# EAGLE schematic purple_v2 (EAGLE 8.0.0)
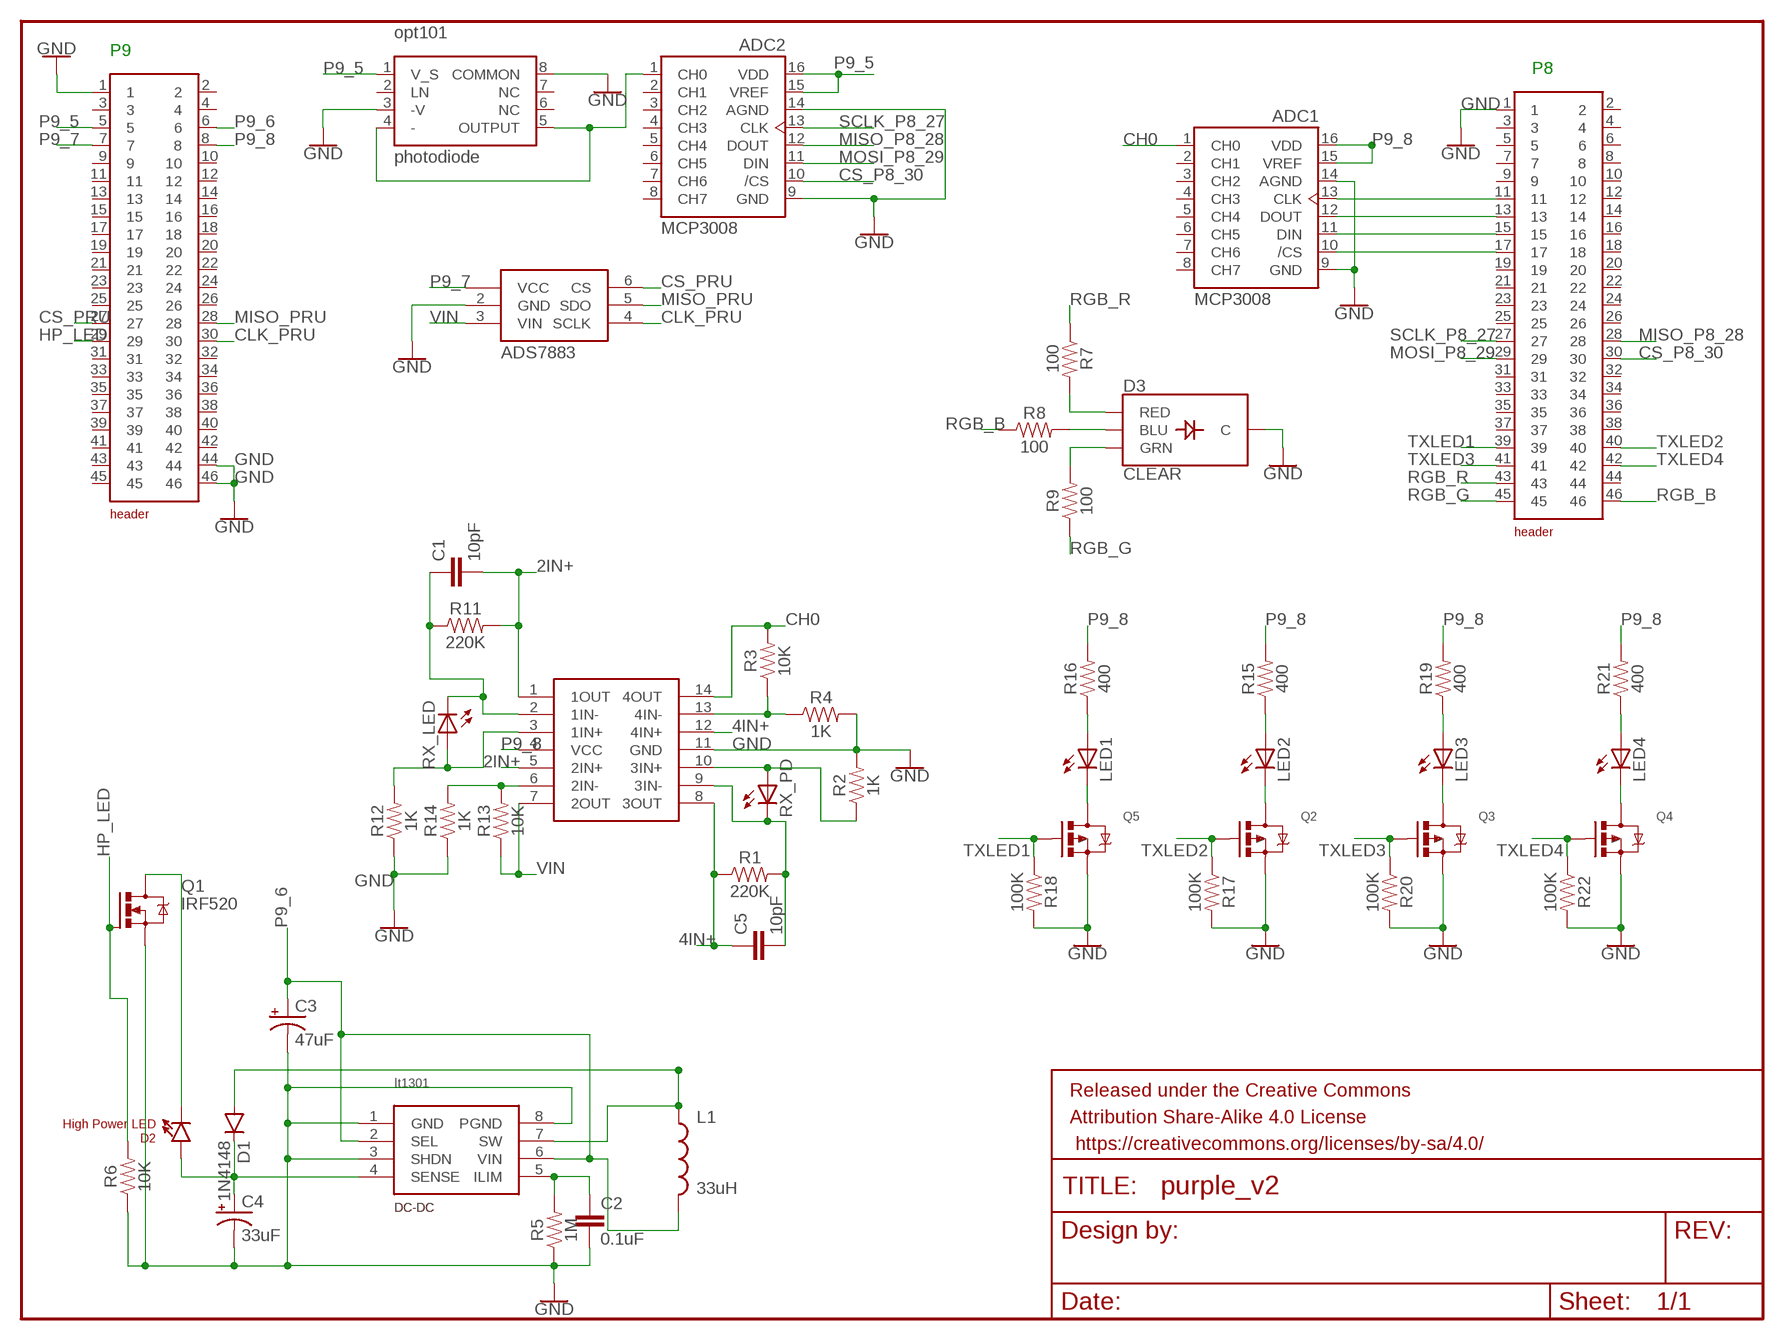
[diagram p0: schematic, sheet 1]

## Parts
ADC1  MCP3008-SO16  [SO16]
ADC2  MCP3008-SO16  [SO16]
C1  10pF  10PF-0603-50V-5%  [0603]
C2  0.1uF  CAPPTH  [CAP-PTH-SMALL]
C3  47uF  CAP_POLPTH2  [CPOL-RADIAL-10UF-25V]
C4  33uF  CAP_POLPTH2  [CPOL-RADIAL-10UF-25V]
C5  10pF  10PF-0603-50V-5%  [0603]
D1  1N4148  DIODE1N4148  [DIODE-1N4148]
D2  High Power LED  LTE-302  [LTE-302]
D3  CLEAR  LED-RGB-CCCLEAR  [LED-RGB-THRU]
FRAME1  FRAME-LETTERNO_PACKAGE  [DUMMY]
J1  223  [2*23]
J2  223  [2*23]
L1  33uH  INDUCTORRLB0912  [RLB0912]
LED1  LED5MM  [LED5MM]
LED2  LED5MM  [LED5MM]
LED3  LED5MM  [LED5MM]
LED4  LED5MM  [LED5MM]
OP-AMP  TLC2274-SO14  [SO14]
Q1  IRF520  [TO220BV]
Q2  MOSFET-PCHANNEL  [SOT23-3]
Q3  MOSFET-PCHANNEL  [SOT23-3]
Q4  MOSFET-PCHANNEL  [SOT23-3]
Q5  MOSFET-PCHANNEL  [SOT23-3]
R1  220K  0.3OHM-0805-1/8W-1%  [0805]
R2  1K  0.3OHM-0805-1/8W-1%  [0805]
R3  10K  0.3OHM-0805-1/8W-1%  [0805]
R4  1K  0.3OHM-0805-1/8W-1%  [0805]
R5  1M  0.3OHM-0805-1/8W-1%  [0805]
R6  10K  0.3OHM-0805-1/8W-1%  [0805]
R7  100  0.3OHM-0805-1/8W-1%  [0805]
R8  100  0.3OHM-0805-1/8W-1%  [0805]
R9  100  0.3OHM-0805-1/8W-1%  [0805]
R11  220K  0.3OHM-0805-1/8W-1%  [0805]
R12  1K  0.3OHM-0805-1/8W-1%  [0805]
R13  10K  0.3OHM-0805-1/8W-1%  [0805]
R14  1K  0.3OHM-0805-1/8W-1%  [0805]
R15  400  0.3OHM-0805-1/8W-1%  [0805]
R16  400  0.3OHM-0805-1/8W-1%  [0805]
R17  100K  0.3OHM-0805-1/8W-1%  [0805]
R18  100K  0.3OHM-0805-1/8W-1%  [0805]
R19  400  0.3OHM-0805-1/8W-1%  [0805]
R20  100K  0.3OHM-0805-1/8W-1%  [0805]
R21  400  0.3OHM-0805-1/8W-1%  [0805]
R22  100K  0.3OHM-0805-1/8W-1%  [0805]
RX_LED  LED5MM  [LED5MM]
RX_PD  LED5MM  [LED5MM]
U5  LT1301  [DIL08]
U9  OPT101  [OPT101]
U$1  ADS7883  [SOT23-6]

## Nets
2IN+: C1.2 OP-AMP.1(1OUT) OP-AMP.5(2IN+) R11.2
4IN+: C5.1 OP-AMP.8(3OUT) OP-AMP.12(4IN+) R1.1
CH0: ADC1.1(CH0) OP-AMP.14(4OUT) R3.2
CLK_1: ADC1.13(CLK) J2.11
CLK_PRU: J1.30 U$1.4(SCLK)
CS_1: ADC1.10(/CS) J2.17
CS_P8_30: ADC2.10(/CS) J2.30
CS_PRU: J1.27 U$1.6(CS)
DIN_1: ADC1.11(DIN) J2.15
DOUT_1: ADC1.12(DOUT) J2.13
GND: ADC1.9(GND) ADC1.14(AGND) ADC2.9(GND) ADC2.14(AGND) C2.2 C3.2(-) C4.2(-) D3.2(C) J1.1 J1.44 J1.46 J2.1 OP-AMP.11(GND) Q1.S Q2.2(S) Q3.2(S) Q4.2(S) Q5.2(S) R2.2 R4.2 R5.1 R6.1 R12.1 R14.1 R17.2 R18.2 R20.2 R22.2 U5.1(GND) U5.3(SHDN) U5.8(PGND) U9.3(-V) U9.8(COMMON) U$1.2(GND)
HP_LED: J1.29 Q1.G R6.2
MISO_P8_28: ADC2.12(DOUT) J2.28
MISO_PRU: J1.28 U$1.5(SDO)
MOSI_P8_29: ADC2.11(DIN) J2.29
N$1: D3.1(RED) R7.2
N$2: OP-AMP.13(4IN-) R3.1 R4.1
N$3: D3.4(BLU) R8.2
N$4: D3.3(GRN) R9.2
N$5: OP-AMP.10(3IN+) R2.1 RX_PD.A
N$6: C5.2 OP-AMP.9(3IN-) R1.2 RX_PD.K(C)
N$8: C1.1 OP-AMP.2(1IN-) R11.1 RX_LED.K(C)
N$9: LED2.A R15.1
N$10: OP-AMP.3(1IN+) R12.2 RX_LED.A
N$11: OP-AMP.6(2IN-) R13.2 R14.2
N$12: LED1.A R16.1
N$13: D2.C Q1.D
N$14: ADC2.1(CH0) U9.4(-) U9.5(OUTPUT)
N$15: LED2.K(C) Q2.3(D)
N$16: LED1.K(C) Q5.3(D)
N$17: LED3.A R19.1
N$18: D1.A L1.1 U5.7(SW)
N$19: C4.1(+) D1.C D2.A U5.4(SENSE)
N$20: C2.1 R5.2 U5.5(ILIM)
N$21: LED3.K(C) Q3.3(D)
N$22: LED4.A R21.1
N$23: LED4.K(C) Q4.3(D)
P9_5: ADC2.15(VREF) ADC2.16(VDD) J1.5 U9.1(V_S)
P9_6: C3.1(+) J1.6 L1.2 U5.2(SEL) U5.6(VIN)
P9_7: J1.7 U$1.1(VCC)
P9_8: ADC1.15(VREF) ADC1.16(VDD) J1.8 OP-AMP.4(VCC) R15.2 R16.2 R19.2 R21.2
RGB_B: J2.46 R8.1
RGB_G: J2.45 R9.1
RGB_R: J2.43 R7.1
SCLK_P8_27: ADC2.13(CLK) J2.27
TXLED1: J2.39 Q5.1(G) R18.1
TXLED2: J2.40 Q2.1(G) R17.1
TXLED3: J2.41 Q3.1(G) R20.1
TXLED4: J2.42 Q4.1(G) R22.1
VIN: OP-AMP.7(2OUT) R13.1 U$1.3(VIN)
Unconnected: ADC1.2(CH1) ADC1.3(CH2) ADC1.4(CH3) ADC1.5(CH4) ADC1.6(CH5) ADC1.7(CH6) ADC1.8(CH7) ADC2.2(CH1) ADC2.3(CH2) ADC2.4(CH3) ADC2.5(CH4) ADC2.6(CH5) ADC2.7(CH6) ADC2.8(CH7) J1.2 J1.3 J1.4 J1.9 J1.10 J1.11 J1.12 J1.13 J1.14 J1.15 J1.16 J1.17 J1.18 J1.19 J1.20 J1.21 J1.22 J1.23 J1.24 J1.25 J1.26 J1.31 J1.32 J1.33 J1.34 J1.35 J1.36 J1.37 J1.38 J1.39 J1.40 J1.41 J1.42 J1.43 J1.45 J2.2 J2.3 J2.4 J2.5 J2.6 J2.7 J2.8 J2.9 J2.10 J2.12 J2.14 J2.16 J2.18 J2.19 J2.20 J2.21 J2.22 J2.23 J2.24 J2.25 J2.26 J2.31 J2.32 J2.33 J2.34 J2.35 J2.36 J2.37 J2.38 J2.44 U9.2(LN) U9.6(NC) U9.7(NC)

## Notes on the sheet
- P9
- P8

## Library data of the parts
ADC1 ADC2 = adafruit:MCP3008-SO16
C1 C5 = SparkFun-Capacitors:10PF: 10pF ceramic capacitors A capacitor is a passive two-terminal electrical component used to store electrical energy temporarily in an electric field.; PROD_ID: CAP-11812
C2 = SparkFun-Capacitors:CAP: Capacitor Standard 0603 ceramic capacitor, and 0.1" leaded capacitor.
C3 C4 = SparkFun-Capacitors:CAP_POL: Capacitor Polarized These are standard SMD and PTH capacitors. Normally 10uF, 47uF, and 100uF in electrolytic and tantalum varieties. Always verify the external diameter of the through hole cap, it varies with capacity, voltage, and manufacturer. The EIA devices should be standard.
D1 = SparkFun-DiscreteSemi:DIODE: Diode These are standard reverse protection diodes and small signal diodes. SMA package can handle up to about 1A. SOD-323 can handle about 200mA. What the SOD-323 package when ordering, there are some mfgs out there that are 5-pin packages.
D2 = SparkFun-LED:LTE-302: Through-hole side-firing 940nm IR LED
D3 = SparkFun-LED:LED-RGB-CC: LED-RGB Common Cathode Packages: LED RGB-THRU LED_PIRANHA_5MM SparkFun Products: RGB Diffused Common Cathode- Diffuse <[https://www.sparkfun.com/products/9264]> RGB Diffused Common Cathode - Clear <[https://www.sparkfun.com/products/105]> LED-RGB 5mm Square (Piranha) <[https://www.sparkfun.com/products/11679]>; PROD_ID: DIO-08418
FRAME1 = SparkFun-Aesthetics:FRAME-LETTER: Schematic Frame Standard 8.5x11 US Letter frame; DESIGNER: Nobody; VERSION: v01
J1 J2 = header:2*23: connectors 2*23
L1 = SparkFun-Passives:INDUCTOR: Inductors Basic Inductor/Choke - 0603 and 1206. Footprints are not proven and vary greatly between part numbers. SRN6045- 33uH, 20% 1.4A SDR0403-560KL - 56uH, 10%, 500mA RMS/740mA peak
LED1-LED4 RX_LED RX_PD = adafruit:LED: LED OSRAM: - CHIPLED LG R971, LG N971, LY N971, LG Q971, LY Q971, LO R971, LY R971 LH N974, LH R974 LS Q976, LO Q976, LY Q976 LO Q996 - Hyper CHIPLED LW Q18S LB Q993, LB Q99A, LB R99A - SideLED LS A670, LO A670, LY A670, LG A670, LP A670 LB A673, LV A673, LT A673, LW A673 LH A674 LY A675 LS A676, LA A676, LO A676, LY A676, LW A676 LS A679, LY A679, LG A679 - Hyper Micro SIDELED® LS Y876, LA Y876, LO Y876, LY Y876 LT Y87S - SmartLED LW L88C, LW L88S LB L89C, LB L89S, LG L890 LS L89K, LO L89K, LY L89K LS L896, LA L896, LO L896, LY L896 - TOPLED LS T670, LO T670, LY T670, LG T670, LP T670 LSG T670, LSP T670, LSY T670, LOP T670, LYG T670 LG T671, LOG T671, LSG T671 LB T673, LV T673, LT T673, LW T673 LH T674 LS T676, LA T676, LO T676, LY T676, LB T676, LH T676, LSB T676, LW T676 LB T67C, LV T67C, LT T67C, LS T67K, LO T67K, LY T67K, LW E67C LS E67B, LA E67B, LO E67B, LY E67B, LB E67C, LV E67C, LT E67C LW T67C LS T679, LY T679, LG T679 LS T770, LO T770, LY T770, LG T770, LP T770 LB T773, LV T773, LT T773, LW T773 LH T774 LS E675, LA E675, LY E675, LS T675 LS T776, LA T776, LO T776, LY T776, LB T776 LHGB T686 LT T68C, LB T68C - Hyper Mini TOPLED® LB M676 - Mini TOPLED Santana® LG M470 LS M47K, LO M47K, LY M47K Source: http://www.osram.convergy.de/
OP-AMP = adafruit:TLC2274-SO14
Q1 = transistor-power:IRF520: HEXFET Power MOSFET
Q2-Q5 = User-Submitted:MOSFET-PCHANNEL: Generic PMOSFET IRLML2244 - TRANS-11153 (SOT-23 -20V -4.3A) (1.Gate 2.Source 3.Drain) FQP27P06 - COM-10349 <http://www.sparkfun.com/products/10349> (TO-220 -60V -27A) (1.Gate 2.Source 3.Drain); PROD_ID: TRANS-08285
R1-R9 R11-R22 = SparkFun-Resistors:0.3OHM: 0.3Ω resistor A resistor is a passive two-terminal electrical component that implements electrical resistance as a circuit element. Resistors act to reduce current flow, and, at the same time, act to lower voltage levels within circuits. - Wikipedia; PROD_ID: RES-11622; VALUE: 0.3
U5 = SparkFun-DigitalIC:LT1301: LT1301 - DC-DC Converter Technical Specifications: VCC: 3.3-5V Operating Temperature: -40°C to 85°C Output: 12v 120mA
U9 = TCL272:OPT101: opt101 - photodiode Technical Specifications: dip 8
U$1 = vlc:ADS7883